# EasyEDA schematic SCH_Pult-v1.1_2025-10-03.json

## Sheets
1 Power Source ＆ Charging Circuit
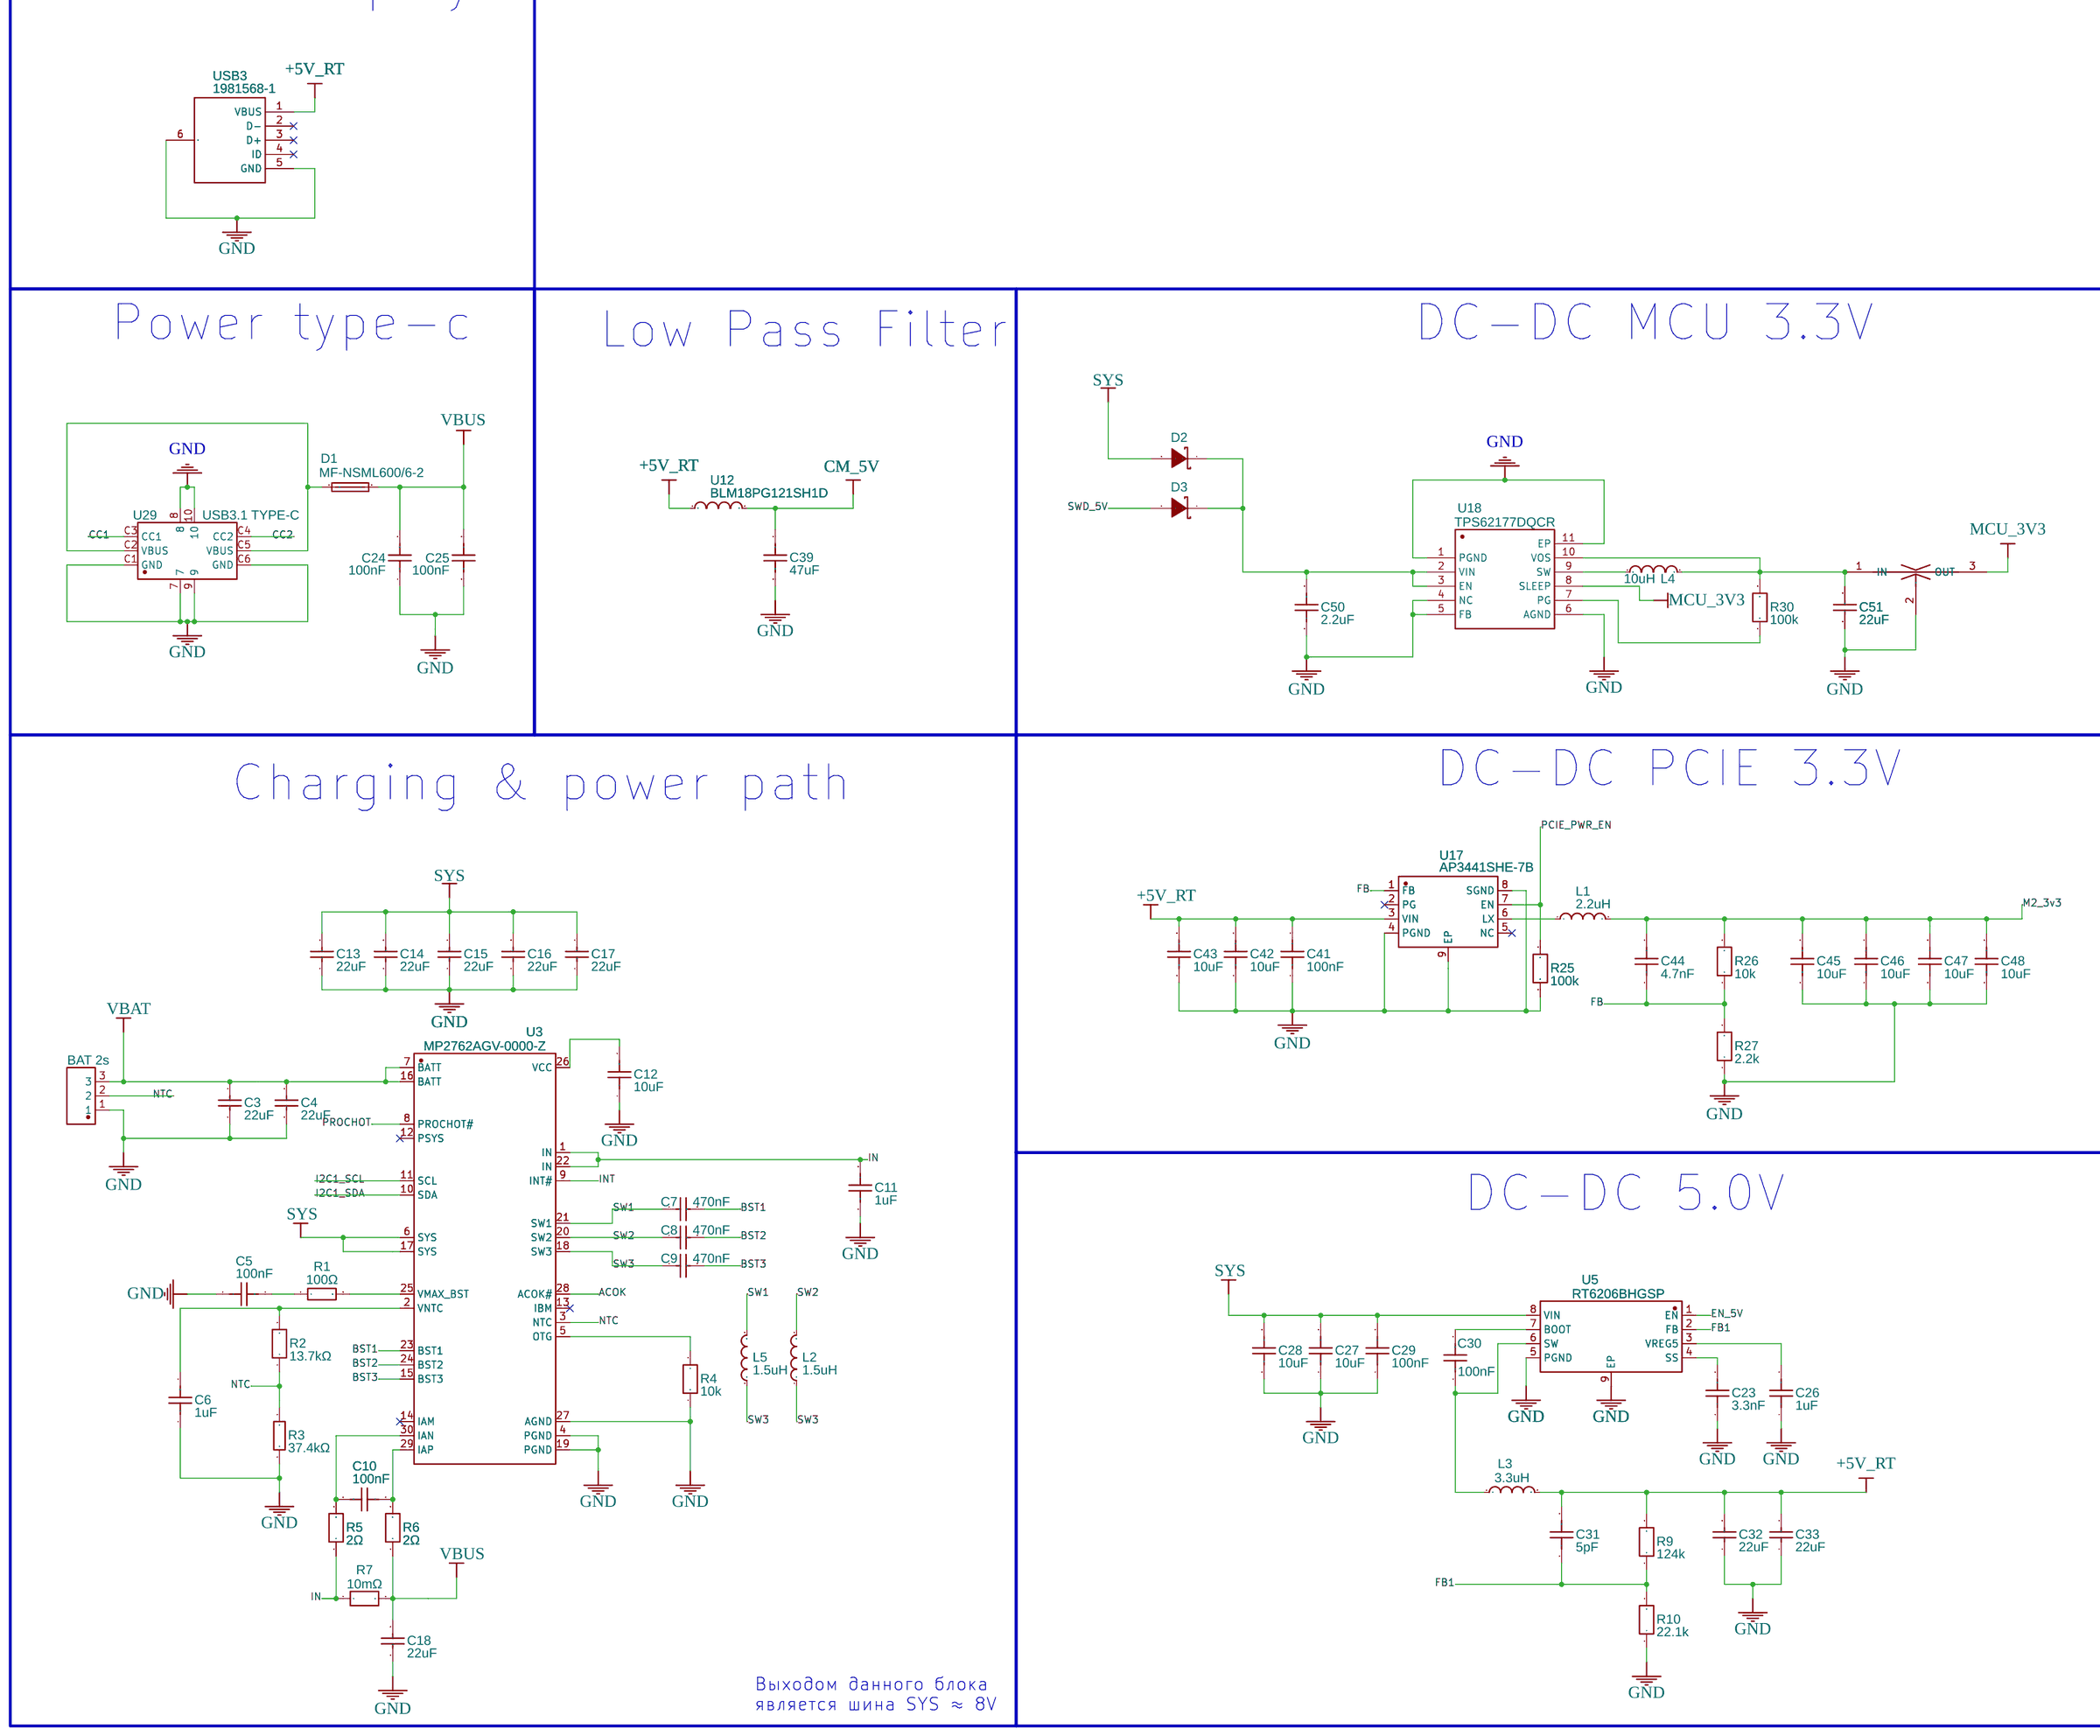
[diagram p0: Power Source ＆ Charging Circuit]
2 MCU and Stick & Button
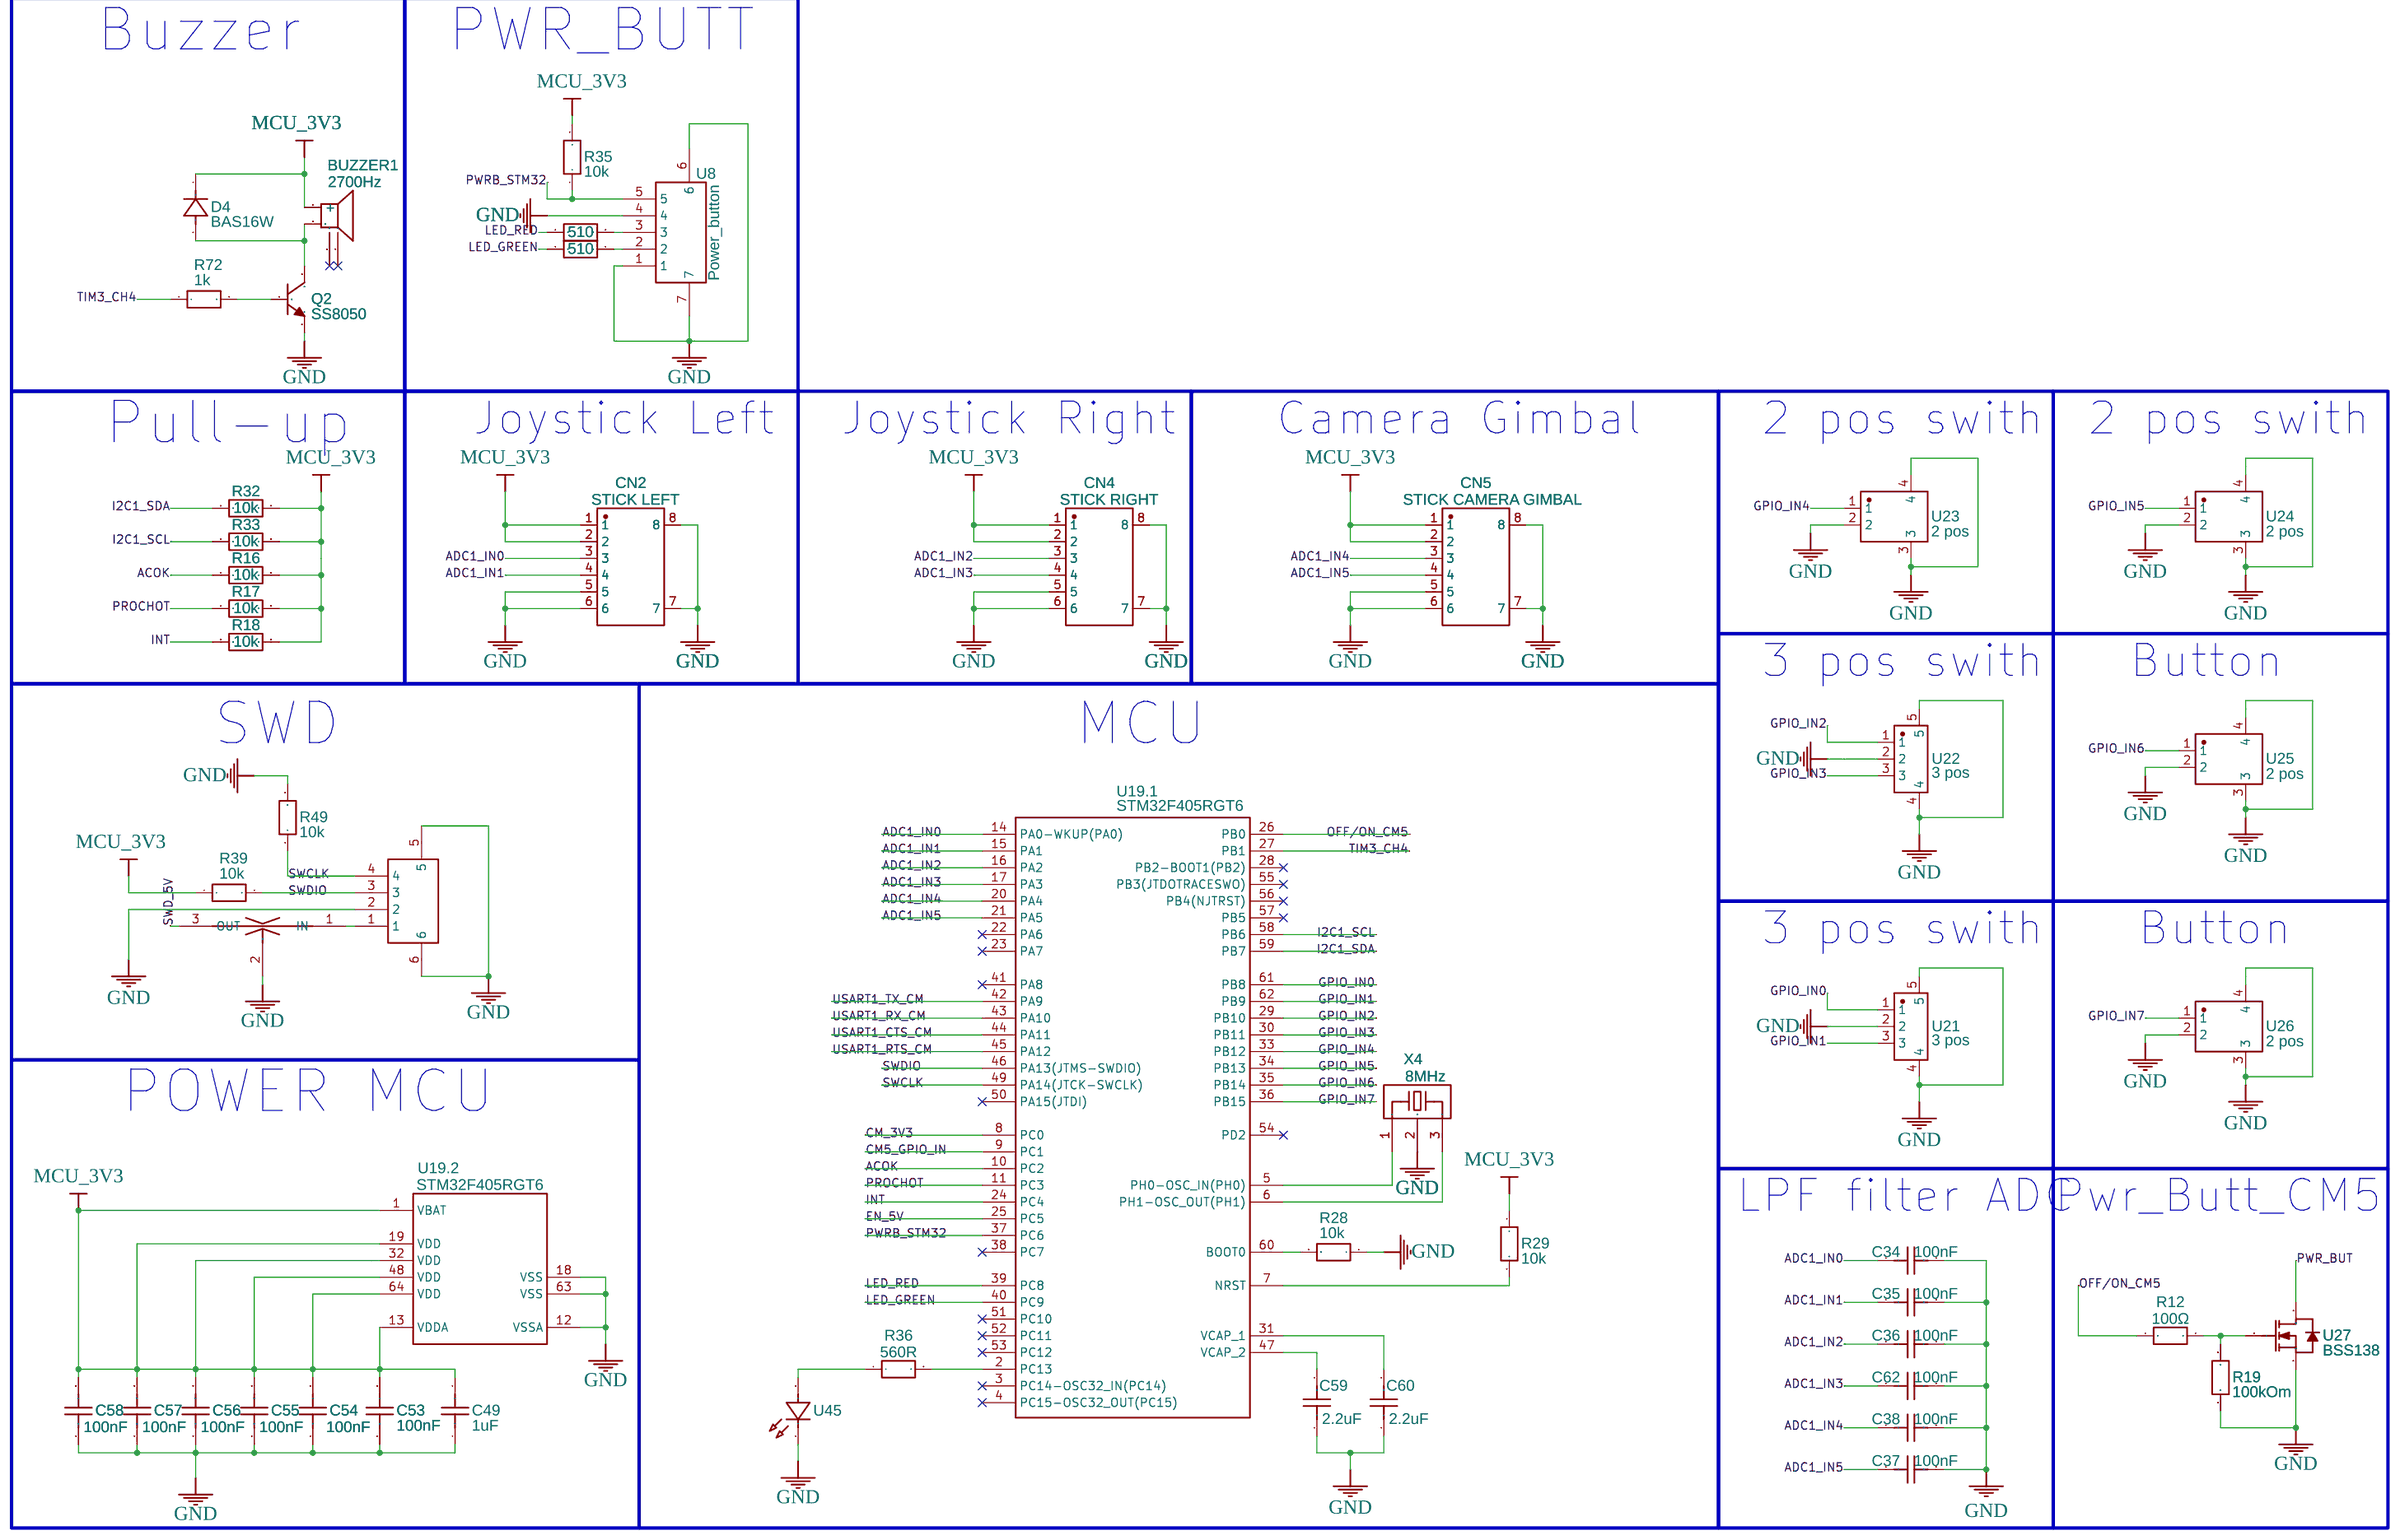
[diagram p1: MCU and Stick & Button]
3 Raspberry CM5
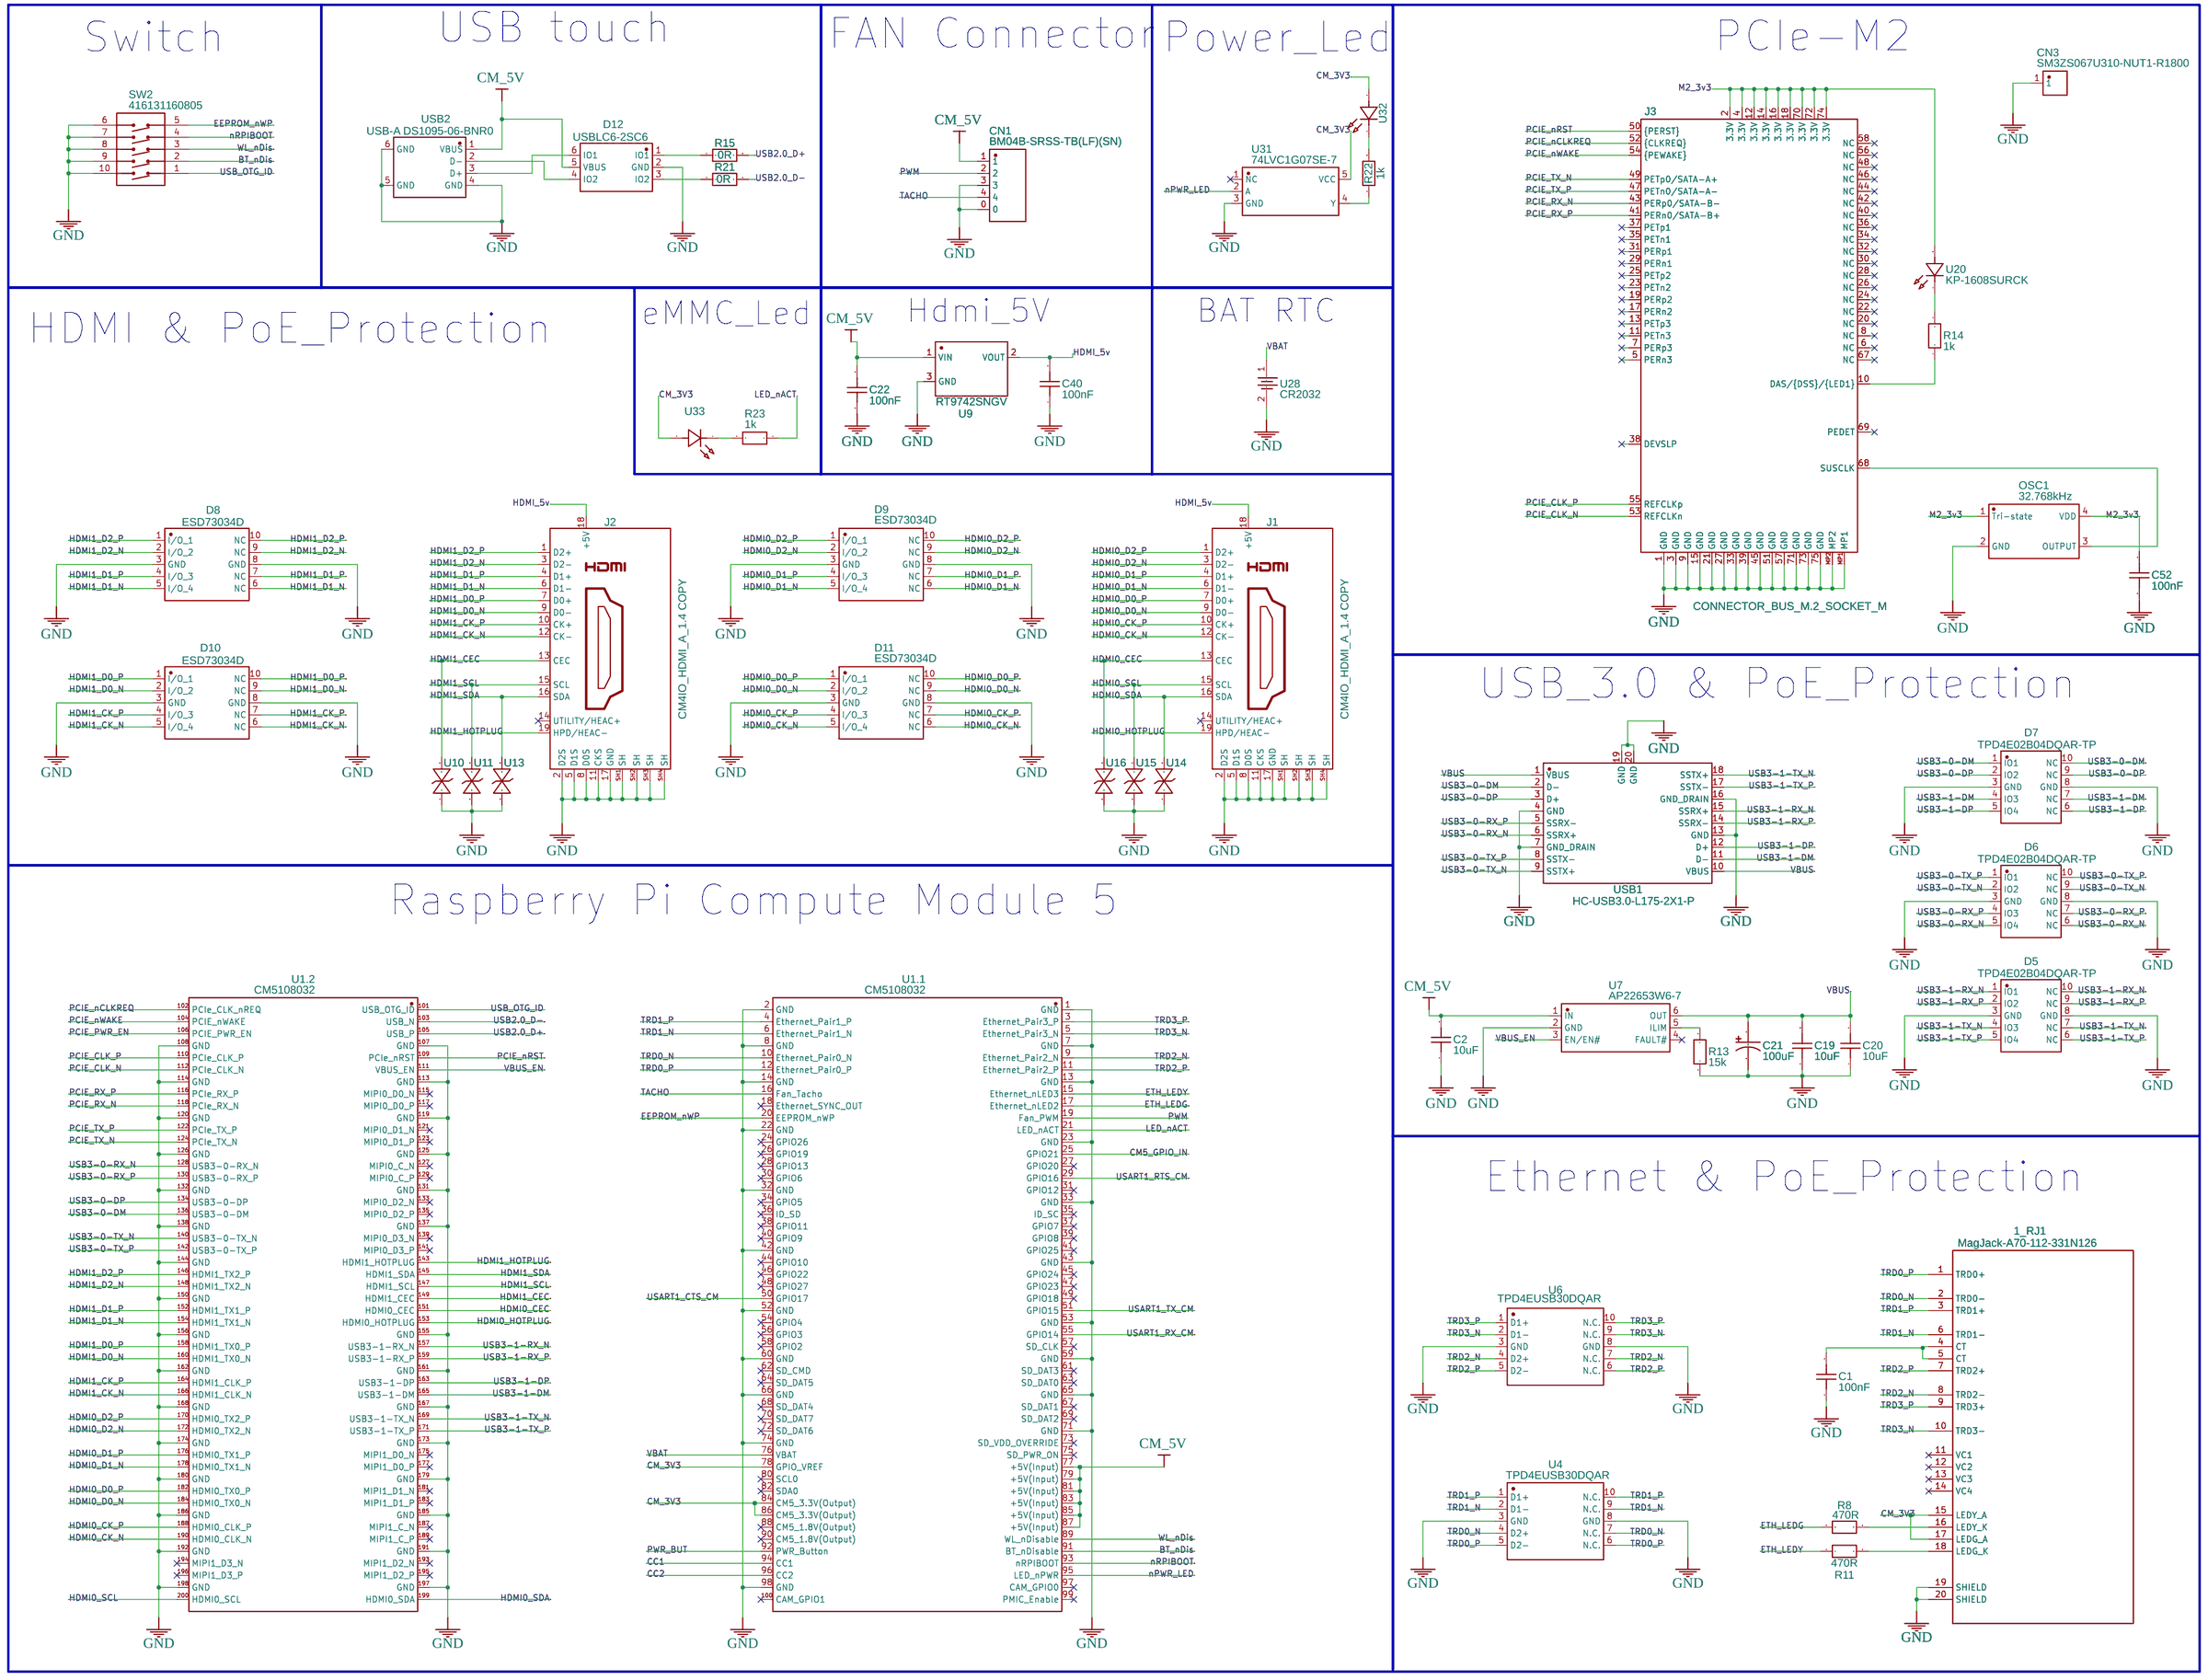
[diagram p2: Raspberry CM5]

## Parts
sheet MCU and Stick & Button
BUZZER1  2700Hz  [BUZ-SMD_4P-L8.5-W8.5-P8.50-BR]
C34  100nF  [C0603]
C35  100nF  [C0603]
C36  100nF  [C0603]
C37  100nF  [C0603]
C38  100nF  [C0603]
C49  1uF  [C0603]
C53  100nF  [C0603]
C54  100nF  [C0603]
C55  100nF  [C0603]
C56  100nF  [C0603]
C57  100nF  [C0603]
C58  100nF  [C0603]
C59  2.2uF  [C0603]
C60  2.2uF  [C0603]
C61  -  [FILTER-SMD_3P-L1.6-W0.8-L_NFM18CC223R1C3D]
C62  100nF  [C0603]
CN2  STICK LEFT  [CONN-TH_SM06B-GHS-TB-LF-SN]
CN4  STICK RIGHT  [CONN-TH_SM06B-GHS-TB-LF-SN]
CN5  STICK CAMERA GIMBAL  [CONN-TH_SM06B-GHS-TB-LF-SN]
D4  BAS16W  [SOD-123_L2.7-W1.6-LS3.7-RD]
Q2  SS8050  [SOT-23-3_L2.9-W1.3-P1.90-LS2.4-BR]
R12  100Ω  [R0402]
R16  10k  [R0603]
R17  10k  [R0603]
R18  10k  [R0603]
R19  100kOm  [R0402]
R20  510  [R0603]
R28  10k  [R0603]
R29  10k  [R0603]
R32  10k  [R0603]
R33  10k  [R0603]
R34  510  [R0603]
R35  10k  [R0603]
R36  560R  [R0603]
R39  10k  [R0603]
R49  10k  [R0603]
R72  1k  [R0603]
U8  Power_button  [CONN-SMD_5P-P1.25_SM05B-GHS-TB-LF-SN]
U19  STM32F405RGT6  [LQFP-64_L10.0-W10.0-P0.50-LS12.0-BL]  (sections 1,2)
U21  3 pos  [CONN-TH_SM03B-GHS-TB-LF-SN]
U22  3 pos  [CONN-TH_SM03B-GHS-TB-LF-SN]
U23  2 pos  [CONN-SMD_SM02B-GHS-TB-LF-SN]
U24  2 pos  [CONN-SMD_SM02B-GHS-TB-LF-SN]
U25  2 pos  [CONN-SMD_SM02B-GHS-TB-LF-SN]
U26  2 pos  [CONN-SMD_SM02B-GHS-TB-LF-SN]
U27  BSS138  [SOT-23-3_L2.9-W1.4-P1.90-LS2.5-BR]
U30  SM04B-GHS-TB(LF)(SN)  [CONN-SMD_4P-P1.25_SM04B-GHS-TB-LF-SN]
U45  KP-1608SURCK  [LED0603-RD_RED]
X4  8MHz  [OSC-SMD_3P-L3.2-W1.3-P1.2-L]
sheet Power Source ＆ Charging Circuit
C3  22uF  [C0805]
C4  22uF  [C0805]
C5  100nF  [C0603]
C6  1uF  [C0603]
C7  470nF  [C0603]
C8  470nF  [C0603]
C9  470nF  [C0603]
C10  100nF  [C0603]
C11  1uF  [C0603]
C12  10uF  [C0603]
C13  22uF  [C0805]
C14  22uF  [C0805]
C15  22uF  [C0805]
C16  22uF  [C0805]
C17  22uF  [C0805]
C18  22uF  [C0805]
C23  3.3nF  [C0603]
C24  100nF  [C0603]
C25  100nF  [C0603]
C26  1uF  [C0603]
C27  10uF  [C0603]
C28  10uF  [C0603]
C29  100nF  [C0603]
C30  100nF  [C0603]
C31  5pF  [C0603]
C32  22uF  [C0805]
C33  22uF  [C0805]
C39  47uF  [C0603]
C41  100nF  [C0603]
C42  10uF  [C0603]
C43  10uF  [C0603]
C44  4.7nF  [C0603]
C45  10uF  [C0603]
C46  10uF  [C0603]
C47  10uF  [C0603]
C48  10uF  [C0603]
C50  2.2uF  [C0603]
C51  22uF  [C0805]
C63  -  [FILTER-SMD_3P-L1.6-W0.8-L_NFM18CC223R1C3D]
D1  MF-NSML600/6-2  [F1206]
D2  BAT60AE6327HTSA1  [SOD-323_L1.8-W1.3-LS2.5-RD]
D3  BAT60AE6327HTSA1  [SOD-323_L1.8-W1.3-LS2.5-RD]
L1  2.2uH  [IND-SMD_L3.0-W3.0_IHLP-1212BZ]
L2  1.5uH  [IND-SMD_L5.5-W5.2]
L3  3.3uH  [IND-SMD_L6.5-W6.5_IHLP-2525]
L4  10uH  [IND-SMD_L4.0-W4.0_VLCF4020]
L5  1.5uH  [IND-SMD_L5.5-W5.2]
R1  100Ω  [R0603]
R2  13.7kΩ  [R0603]
R3  37.4kΩ  [R0603]
R4  10k  [R0603]
R5  2Ω  [R0603]
R6  2Ω  [R0603]
R7  10mΩ  [R1206]
R9  124k  [R0603]
R10  22.1k  [R0603]
R25  100k  [R0603]
R26  10k  [R0603]
R27  2.2k  [R0603]
R30  100k  [R0603]
U2  BAT 2s  [CONN-TH_XH2.54-3P]
U3  MP2762AGV-0000-Z  [QFN-30_L5.0-W4.0-P0.50-TL_MP2762A]
U5  RT6206BHGSP  [SOP-8_L4.9-W3.9-P1.27-LS6.0-BL-EP-2]
U12  BLM18PG121SH1D  [L0603]
U17  AP3441SHE-7B  [DFN2020-8_L2.0-W2.0-P0.50-BL-EP]
U18  TPS62177DQCR  [WSON-10_L3.0-W2.0-P0.50-BL-EP]
U29  USB3.1 TYPE-C  [USB-TYPE-C-SMD_TYPE-C-6P-USB3.1TYPE-C06PF-073]
USB3  1981568-1  [MICRO-USB-SMD_1981568-1]
sheet Raspberry CM5
1_RJ1  MagJack-A70-112-331N126  [TRJG0926HENL_MAGJACK1]
C1  100nF  [C0603]
C2  10uF  [C0603]
C19  10uF  [C0603]
C20  10uF  [C0603]
C21  100uF  [CAP-SMD_BD6.3-L6.6-W6.6-LS7.2-FD]
C22  100nF  [C0603]
C40  100nF  [C0603]
C52  100nF  [C0603]
CN1  BM04B-SRSS-TB(LF)(SN)  [CONN-SMD_BM04B-SRSS-TB]
CN3  SM3ZS067U310-NUT1-R1800  [SMD-1_BD4.5-D2.5]
D5  TPD4E02B04DQAR-TP  [DFN2510-10_L2.5-W1.0-P0.50-BL]
D6  TPD4E02B04DQAR-TP  [DFN2510-10_L2.5-W1.0-P0.50-BL]
D7  TPD4E02B04DQAR-TP  [DFN2510-10_L2.5-W1.0-P0.50-BL]
D8  ESD73034D  [DFN-10_L2.5-W1.0-P0.50-BL-2]
D9  ESD73034D  [DFN-10_L2.5-W1.0-P0.50-BL-2]
D10  ESD73034D  [DFN-10_L2.5-W1.0-P0.50-BL-2]
D11  ESD73034D  [DFN-10_L2.5-W1.0-P0.50-BL-2]
D12  USBLC6-2SC6  [SOT-23-6_L2.9-W1.6-P0.95-LS2.8-BL]
J1  CM4IO_HDMI_A_1.4 COPY  [CM4IO:EDAC 690-019-298-412]
J2  CM4IO_HDMI_A_1.4 COPY  [CM4IO:EDAC 690-019-298-412]
J3  CONNECTOR_BUS_M.2_SOCKET_M  [A_HDJ_LIBRARY:PCIE_M.2_CONNECTORS_P=0.5MM_H=4.2MM_KEYM]
OSC1  32.768kHz  [OSC-SMD_4P-L3.2-W2.5-BL-1]
R8  470R  [R0603]
R11  470R  [R0603]
R13  15k  [R0603]
R14  1k  [R0603]
R15  0R  [R0603]
R21  0R  [R0603]
R22  1k  [R0603]
R23  1k  [R0603]
SW2  416131160805  [SW-SMD_416131160805]
U1  CM5108032  [COMM-SMD_L55.0-W40.0_CM5]  (sections 1,2)
U4  TPD4EUSB30DQAR  [USON-10_L2.5-W1.0-P0.50-BL]
U6  TPD4EUSB30DQAR  [USON-10_L2.5-W1.0-P0.50-BL]
U7  AP22653W6-7  [SOT-23-6_L2.9-W1.6-P0.95-LS2.8-BR]
U9  RT9742SNGV  [SOT-23-3_L2.9-W1.6-P1.90-LS2.8-BR]
U10  ESD5311N  [DFN1006-2L-BI]
U11  ESD5311N  [DFN1006-2L-BI]
U13  ESD5311N  [DFN1006-2L-BI]
U14  ESD5311N  [DFN1006-2L-BI]
U15  ESD5311N  [DFN1006-2L-BI]
U16  ESD5311N  [DFN1006-2L-BI]
U20  KP-1608SURCK  [LED0603-RD_RED]
U28  CR2032  [BAT-TH_CR2032-1]
U31  74LVC1G07SE-7  [SC-88A_L2.0-W1.3-P0.65-LS2.1-BL]
U32  KP-1608SURCK  [LED0603-RD_RED]
U33  KP-1608SURCK  [LED0603-RD_RED]
USB1  HC-USB3.0-L175-2X1-P  [USB-A-TH_H181-AF2R06-12ALCR]
USB2  USB-A DS1095-06-BNR0  [USB-A DS1095-06-BNR)]

## Library data of the parts
BUZZER1 = MLT-8530: Supplier: LCSC; Manufacturer: 华能; Supplier Part: C94599; JLCPCB Part Class: Extended Part
C1 C2 C6 C19 C20 C22 C23 C26-C31 C34-C50 C52-C60 C62 = C_0603_US: Contributor: LCEDA_Lib
C61 C63 = NFM18PC104R1C3D: Supplier: LCSC; Manufacturer: muRata(村田); Supplier Part: C111493; JLCPCB Part Class: Extended Part
CN2 CN4 CN5 = SM06B-GHS-TB(LF)(SN): Contributor: LCSC; Supplier: LCSC; Supplier Part: C133065; Manufacturer: JST; JLCPCB Part Class: Extended Part
D4 = BAS16W_C699061: Contributor: LCSC; Supplier: LCSC; Supplier Part: C699061; Manufacturer: YANGJIE(扬杰); JLCPCB Part Class: Extended Part
Q2 = SS8050: Contributor: LCSC; Supplier: LCSC; Supplier Part: C908250; Manufacturer: FUXINSEMI(富芯森美); JLCPCB Part Class: Extended Part
R12 R19 = R_0402_EU: Contributor: LCEDA_Lib
R2 R4-R6 R8-R11 R13-R18 R20-R23 R25-R30 R32-R36 R39 R49 R72 = R_0603_EU: Contributor: LCEDA_Lib
U8 = SM05B-GHS-TB(LF)(SN): Contributor: LCSC; Supplier: LCSC; Supplier Part: C189896; Manufacturer: JST; JLCPCB Part Class: Extended Part
U19 = STM32F405RGT6: tags: STM32; subpart_no: 1; image: http://image.lceda.cn/szlcsc/C15742.jpg; Supplier Part: C15742; Supplier: LCSC; Manufacturer: ST(意法半导体); JLCPCB Part Class: Extended Part
U21 U22 = SM03B-GHS-TB(LF)(SN): Contributor: LCSC; Supplier: LCSC; Supplier Part: C514175; Manufacturer: JST; JLCPCB Part Class: Extended Part
U23-U26 = SM02B-GHS-TB(LF)(SN): Contributor: LCSC; Supplier: LCSC; Supplier Part: C189893; Manufacturer: JST; JLCPCB Part Class: Extended Part
U27 = BSS138: Supplier: LCSC; Supplier Part: C19272192; Manufacturer: Zhengxin(正芯); Contributor: lcsc
U30 = SM04B-GHS-TB(LF)(SN): Contributor: LCSC; Supplier: LCSC; Supplier Part: C189895; Manufacturer: JST; JLCPCB Part Class: Extended Part
U20 U32 U33 U45 = KP-1608SURCK: Contributor: lcsc; Supplier: LCSC; Supplier Part: C5875718; Manufacturer: Kingbright; JLCPCB Part Class: Extended Part
X4 = CSTCE8M00G52-R0: Supplier: LCSC; Manufacturer: muRata(村田); Supplier Part: C22549; JLCPCB Part Class: Extended Part
C3 C4 C13-C18 C32 C33 C51 = GRM21BR61E226ME44L: Supplier: LCSC; Manufacturer: muRata(村田); Supplier Part: C86816; JLCPCB Part Class: Extended Part
C5 C10 C24 C25 = CC0603KRX7R0BB104: Contributor: LCSC; Supplier: LCSC; Supplier Part: C113803; Manufacturer: YAGEO(国巨); JLCPCB Part Class: Extended Part
C7-C9 = CL10B474KA8NNNC: Supplier: LCSC; Manufacturer: SAMSUNG(三星); Supplier Part: C1623; JLCPCB Part Class: Basic Part
C11 C12 = GRM188R61A105KA61D: Supplier: LCSC; Manufacturer: muRata(村田); Supplier Part: C86012; JLCPCB Part Class: Extended Part
D1 = MF-NSML600/6-2: Contributor: LCSC; Supplier: LCSC; Supplier Part: C1972893; Manufacturer: BOURNS; JLCPCB Part Class: Extended Part
D2 D3 = BAT60AE6327HTSA1: Contributor: LCSC; Supplier: LCSC; Supplier Part: C117485; Manufacturer: Infineon(英飞凌); Manufacturer Part: BAT60AE6327; JLCPCB Part Class: Extended Part
L1 = IHLP1212BZER2R2M11: Contributor: LCSC; Supplier: LCSC; Supplier Part: C553996; Manufacturer: VISHAY(威世); JLCPCB Part Class: Extended Part
L2 L5 = IHLP2020CZER2R2M01: Contributor: lcsc; Supplier: LCSC; Supplier Part: C845003; Manufacturer: VISHAY(威世); JLCPCB Part Class: Extended Part
L3 = IHLP2525CZER3R3M01: Contributor: LCSC; Supplier: LCSC; Supplier Part: C506574; Manufacturer: VISHAY(威世); JLCPCB Part Class: Extended Part
L4 = VLCF4020T-100MR85: Contributor: LCSC; Supplier: LCSC; Manufacturer: TDK; Supplier Part: C136244; JLCPCB Part Class: Extended Part
R1 = AC0603FR-07100RL: Supplier: LCSC; Manufacturer: YAGEO(国巨); Supplier Part: C125923; JLCPCB Part Class: Extended Part
R3 = RC0603FR-0737K4L: Contributor: LCSC; JLCPCB Part Class: Extended Part; Supplier: LCSC; Manufacturer: YAGEO(国巨); Supplier Part: C163425
R7 = WSL1206R0100FEA: Contributor: lcsc; Supplier: LCSC; Supplier Part: C844894; Manufacturer: VISHAY(威世); JLCPCB Part Class: Extended Part
U2 = XH2.54-3P 直插: Contributor: LCSC; Supplier: LCSC; Supplier Part: C9900000727; Manufacturer: null; JLCPCB Part Class: Extended Part
U3 = MP2762AGV-0000-Z: Supplier: LCSC; Supplier Part: C26697965; Manufacturer: MPS(芯源); Contributor: lcsc; JLCPCB Part Class: Extended Part
U5 = RT6206BHGSP: Contributor: LCSC; Supplier: LCSC; Supplier Part: C250401; Manufacturer: RICHTEK(立锜); JLCPCB Part Class: Extended Part
U12 = BLM18PG121SH1D: Contributor: LCSC; Supplier: LCSC; Supplier Part: C354394; Manufacturer: muRata(村田); JLCPCB Part Class: Extended Part
U17 = AP3441SHE-7B: Contributor: LCSC; Supplier: LCSC; Supplier Part: C2070918; Manufacturer: DIODES(美台); JLCPCB Part Class: Extended Part
U18 = TPS62177DQCR: Supplier: LCSC; Manufacturer: TI(德州仪器); Supplier Part: C91241; JLCPCB Part Class: Extended Part
U29 = USB3.1 TYPE-C 06PF-073: Supplier: LCSC; Supplier Part: C9900187208; Manufacturer: null; Contributor: lcsc
USB3 = 1981568-1: Contributor: LCSC; Supplier: LCSC; Supplier Part: C428487; Manufacturer: TE Connectivity(泰科电子); JLCPCB Part Class: Extended Part
1_RJ1 = MagJack-A70-112-331N126: Manufacturer: LINK-PP; link: http://www.link-pp.com/?product/201804116137.html; Contributor: spkt-thi
C21 = 100UF/16V-6.3X5.4: Contributor: LCSC; Supplier: LCSC; Supplier Part: C9900004520; Manufacturer Part: 100uF/16V-6.3x5.4; Manufacturer: null; JLCPCB Part Class: Extended Part
CN1 = BM04B-SRSS-TB(LF)(SN): Contributor: LCSC; Supplier: LCSC; Supplier Part: C160390; Manufacturer: JST; JLCPCB Part Class: Extended Part
CN3 = SM3ZS067U310-NUT1-R1800: Supplier: LCSC; Supplier Part: C5221772; Manufacturer: JAE(日本航空电子); JLCPCB Part Class: Extended Part; Contributor: lcsc
D5-D7 = TPD4E02B04DQAR-TP: Contributor: LCSC; Supplier: LCSC; Supplier Part: C2841426; Manufacturer: TECH PUBLIC(台舟); JLCPCB Part Class: Extended Part
D8-D11 = ESD73034D: Supplier: LCSC; Supplier Part: C7202962; Manufacturer: TECH PUBLIC(台舟); JLCPCB Part Class: Extended Part; Contributor: lcsc
D12 = USBLC6-2SC6_C2827654: Contributor: LCSC; Supplier: LCSC; Supplier Part: C2827654; Manufacturer: TECH PUBLIC(台舟); JLCPCB Part Class: Extended Part
J1 J2 = CM4IO_HDMI_A_1.4 COPY: Symbol: CM4IO_HDMI_A_1.4; Device: CM4IO_HDMI_A_1.4; field4: Farnell; field5: 2614936; field6: 690-019-298-412; field7: EDAC; field8: UCON00802; part description: HDMI Connector, Right Angle, 19 Contacts, Receptacle, Surface Mount, Surface Mount Right Angle; User doc link: https://www.tme.eu/Document/f15dffbcfad8545e17826f72d36911c8/206A-SEAN-R03.pdf; Add into BOM: yes; Convert to PCB: yes; Origin Footprint: CM4IO:EDAC 690-019-298-412; Field4: Farnell; Field5: 2614936; Field6: 690-019-298-412; Field7: EDAC; Part Description: HDMI Connector, Right Angle, 19 Contacts, Receptacle, Surface Mount, Surface Mount Right Angle; Field8: UCON00802; Contributor: Steve Forest
J3 = CONNECTOR_BUS_M.2_SOCKET_M: Symbol: Connector_Bus_M.2_Socket_M; Device: Connector_Bus_M.2_Socket_M; User doc link: http://read.pudn.com/downloads794/doc/project/3133918/PCIe_M.2_Electromechanical_Spec_Rev1.0_Final_11012013_RS_Clean.pdf#page=155; Add into BOM: yes; Convert to PCB: yes; Origin Footprint: PCIe_M.2_Connectors_P=0.5mm_H=4.2mm_KeyM; Comment: Connector_Bus_M.2_Socket_M; Contributor: najsar
OSC1 = ASEK-32.768KHZ-LRT: Contributor: lcsc; Supplier: LCSC; Supplier Part: C2650753; Manufacturer: ABRACON; JLCPCB Part Class: Extended Part
SW2 = 416131160805: Supplier: LCSC; Supplier Part: C6812612; Manufacturer: Wurth(伍尔特); Contributor: lcsc; JLCPCB Part Class: Extended Part
U1 = CM5108032: Supplier: LCSC; Supplier Part: C42394223; Manufacturer: Raspberry Pi(树莓派); subpart_no: 1
U4 U6 = TPD4EUSB30DQAR: Contributor: LCSC; Supplier: LCSC; Manufacturer: TI(德州仪器); Supplier Part: C90627; JLCPCB Part Class: Extended Part
U7 = AP22653W6-7: Contributor: LCSC; Supplier: LCSC; Supplier Part: C2158037; Manufacturer: DIODES(美台); JLCPCB Part Class: Extended Part
U9 = RT9742SNGV COPY: Contributor: LCSC; Supplier: LCSC; Supplier Part: C2892807; Manufacturer: null; JLCPCB Part Class: Extended Part
U10 U11 U13-U16 = ESD5311N: Supplier: LCSC; Supplier Part: C2936982; Manufacturer: TECH PUBLIC(台舟); JLCPCB Part Class: Extended Part; Contributor: lcsc
U28 = CR2032_C9900007674: Contributor: lcsc; Supplier: LCSC; Supplier Part: C9900007674; Manufacturer: null; JLCPCB Part Class: Extended Part
U31 = 74LVC1G07SE-7: Contributor: LCSC; Supplier: LCSC; Supplier Part: C67531; Manufacturer: DIODES(美台); JLCPCB Part Class: Extended Part
USB1 = HC-USB3.0-L175-2X1-P: Supplier: LCSC; Supplier Part: C7501881; Manufacturer: HC(虹成电子); Contributor: lcsc; JLCPCB Part Class: Extended Part
USB2 = USB-A DS1095-06-BNR0: Supplier: LCSC; Supplier Part: C720525; Manufacturer: Zhendin; Manufacturer Part: DS1095-06BNR0; Contributor: Рустем Равилов; JLCPCB Part Class: Extended Part; link: https://www.chipdip.ru/product/ds1095-06-bnr0

## Nets
+5V_RT: C31.2 C32.2 C33.2 C41.2 C42.2 C43.2 L3.2 R9.2 U12.1 U17.3(VIN) USB3.1(VBUS)
GND: 1_RJ1.19(SHIELD) 1_RJ1.20(SHIELD) C1.1 C2.1 C3.1 C4.1 C5.1 C6.1 C11.1 C12.1 C13.1 C14.1 C15.1 C16.1 C17.1 C18.1 C19.1 C20.1 C21.2 C22.1 C23.1 C24.1 C25.1 C26.1 C27.1 C28.1 C29.1 C32.1 C33.1 C34.2 C35.2 C36.2 C37.2 C38.2 C39.1 C40.1 C41.1 C42.1 C43.1 C45.1 C46.1 C47.1 C48.1 C49.1 C50.1 C51.1 C52.2 C53.1 C54.1 C55.1 C56.1 C57.1 C58.1 C59.1 C60.1 C61.2(GND) C62.2 C63.2(GND) CN1.0 CN1.3 CN2.5 CN2.6 CN2.7 CN2.8 CN3.1 CN4.5 CN4.6 CN4.7 CN4.8 CN5.5 CN5.6 CN5.7 CN5.8 D5.3(GND) D5.8(GND) D6.3(GND) D6.8(GND) D7.3(GND) D7.8(GND) D8.3(GND) D8.8(GND) D9.3(GND) D9.8(GND) D10.3(GND) D10.8(GND) D11.3(GND) D11.8(GND) D12.2(GND) J1.2(D2S) J1.5(D1S) J1.8(D0S) J1.11(CKS) J1.17(GND) J1.SH1(SH) J1.SH2(SH) J1.SH3(SH) J1.SH4(SH) J2.2(D2S) J2.5(D1S) J2.8(D0S) J2.11(CKS) J2.17(GND) J2.SH1(SH) J2.SH2(SH) J2.SH3(SH) J2.SH4(SH) J3.1(GND) J3.3(GND) J3.9(GND) J3.15(GND) J3.21(GND) J3.27(GND) J3.33(GND) J3.39(GND) J3.45(GND) J3.51(GND) J3.57(GND) J3.71(GND) J3.73(GND) J3.75(GND) J3.MP1 J3.MP2 OSC1.2(GND) Q2.2(E) R3.2 R4.1 R10.1 R13.1 R19.1 R25.1 R27.1 R28.1 R49.2 SW2.6 SW2.7 SW2.8 SW2.9 SW2.10 U1.1(GND) U1.2(GND) U1.7(GND) U1.8(GND) U1.13(GND) U1.14(GND) U1.22(GND) U1.23(GND) U1.32(GND) U1.33(GND) U1.42(GND) U1.43(GND) U1.52(GND) U1.53(GND) U1.59(GND) U1.60(GND) U1.65(GND) U1.66(GND) U1.71(GND) U1.74(GND) U1.98(GND) U1.107(GND) U1.108(GND) U1.113(GND) U1.114(GND) U1.119(GND) U1.120(GND) U1.125(GND) U1.126(GND) U1.131(GND) U1.132(GND) U1.137(GND) U1.138(GND) U1.144(GND) U1.150(GND) U1.155(GND) U1.156(GND) U1.161(GND) U1.162(GND) U1.167(GND) U1.168(GND) U1.173(GND) U1.174(GND) U1.179(GND) U1.180(GND) U1.185(GND) U1.186(GND) U1.191(GND) U1.192(GND) U1.197(GND) U1.198(GND) U2.1 U3.4(PGND) U3.19(PGND) U3.27(AGND) U4.3(GND) U4.8(GND) U5.5(PGND) U5.9(EP) U6.3(GND) U6.8(GND) U7.2(GND) U8.1 U8.4 U8.6 U8.7 U9.3(GND) U10.1 U11.1 U13.1 U14.1 U15.1 U16.1 U17.4(PGND) U17.8(SGND) U17.9(EP) U18.1(PGND) U18.4(NC) U18.5(FB) U18.6(AGND) U18.11(EP) U19.12(VSSA) U19.18(VSS) U19.63(VSS) U21.2 U21.4 U21.5 U22.2 U22.4 U22.5 U23.2 U23.3 U23.4 U24.2 U24.3 U24.4 U25.2 U25.3 U25.4 U26.2 U26.3 U26.4 U27.2(S) U28.2 U29.7 U29.8 U29.9 U29.10 U29.C1(GND) U29.C6(GND) U30.2 U30.5 U30.6 U31.3(GND) U45.1(K) USB1.4(GND) USB1.7(GND_DRAIN) USB1.13(GND) USB1.16(GND_DRAIN) USB1.19(GND) USB1.20(GND) USB2.4(GND) USB2.5(GND) USB2.6(GND) USB3.5(GND) USB3.6(EH) X4.2
VBAT: C3.2 C4.2 U1.76(VBAT) U2.3 U3.7(BATT) U3.16(BATT) U28.1
VBUS: C18.2 C19.2 C20.2 C21.1 C24.2 C25.2 D1.2 R6.1 R7.2 U7.6(OUT) USB1.1(VBUS) USB1.10(VBUS)
VBUS_EN: U1.111(VBUS_EN) U7.3(EN/EN#)
ACOK: R16.1 U3.28(ACOK#) U19.10(PC2)
ADC1_IN0: C34.1 CN2.3 U19.14(PA0-WKUP(PA0))
ADC1_IN1: C35.1 CN2.4 U19.15(PA1)
ADC1_IN2: C36.1 CN4.3 U19.16(PA2)
ADC1_IN3: C62.1 CN4.4 U19.17(PA3)
ADC1_IN4: C38.1 CN5.3 U19.20(PA4)
ADC1_IN5: C37.1 CN5.4 U19.21(PA5)
BST1: C7.2 U3.23(BST1)
BST2: C8.2 U3.24(BST2)
BST3: C9.2 U3.15(BST3)
BT_nDis: SW2.2 U1.91(BT_nDisable)
CC1: U1.94(CC1) U29.C3(CC1)
CC2: U1.96(CC2) U29.C4(CC2)
CM5_GPIO_IN: U1.25(GPIO21) U19.9(PC1)
CM_3V3: 1_RJ1.15(LEDY_A) 1_RJ1.17(LEDG_A) U1.78(GPIO_VREF) U1.84(CM5_3.3V(Output)) U1.86(CM5_3.3V(Output)) U19.8(PC0) U31.5(VCC) U32.2(A) U33.2(A)
CM_5V: C2.2 C22.2 C39.2 CN1.1 D12.5(VBUS) U1.77(+5V(Input)) U1.79(+5V(Input)) U1.81(+5V(Input)) U1.83(+5V(Input)) U1.85(+5V(Input)) U1.87(+5V(Input)) U7.1(IN) U9.1(VIN) U12.2 USB2.1(VBUS)
EEPROM_nWP: SW2.5 U1.20(EEPROM_nWP)
EN_5V: U5.1(EN) U19.25(PC5)
ETH_LEDG: R8.1 U1.17(Ethernet_nLED2)
ETH_LEDY: R11.1 U1.15(Ethernet_nLED3)
FB: C44.1 R26.1 R27.2 U17.1(FB)
FB1: C31.1 R9.1 R10.2 U5.2(FB)
GPIO_IN0: U19.61(PB8) U21.1
GPIO_IN1: U19.62(PB9) U21.3
GPIO_IN2: U19.29(PB10) U22.1
GPIO_IN3: U19.30(PB11) U22.3
GPIO_IN4: U19.33(PB12) U23.1
GPIO_IN5: U19.34(PB13) U24.1
GPIO_IN6: U19.35(PB14) U25.1
GPIO_IN7: U19.36(PB15) U26.1
HDMI0_CEC: J1.13(CEC) U1.151(HDMI0_CEC) U16.2
HDMI0_CK_N: D11.5(I/O_4) D11.6(NC) J1.12(CK-) U1.190(HDMI0_CLK_N)
HDMI0_CK_P: D11.4(I/O_3) D11.7(NC) J1.10(CK+) U1.188(HDMI0_CLK_P)
HDMI0_D0_N: D11.2(I/O) D11.9(NC) J1.9(D0-) U1.184(HDMI0_TX0_N)
HDMI0_D0_P: D11.1(I/O) D11.10(NC) J1.7(D0+) U1.182(HDMI0_TX0_P)
HDMI0_D1_N: D9.5(I/O_4) D9.6(NC) J1.6(D1-) U1.178(HDMI0_TX1_N)
HDMI0_D1_P: D9.4(I/O_3) D9.7(NC) J1.4(D1+) U1.176(HDMI0_TX1_P)
HDMI0_D2_N: D9.2(I/O) D9.9(NC) J1.3(D2-) U1.172(HDMI0_TX2_N)
HDMI0_D2_P: D9.1(I/O) D9.10(NC) J1.1(D2+) U1.170(HDMI0_TX2_P)
HDMI0_HOTPLUG: J1.19(HPD/HEAC-) U1.153(HDMI0_HOTPLUG)
HDMI0_SCL: J1.15(SCL) U1.200(HDMI0_SCL) U15.2
HDMI0_SDA: J1.16(SDA) U1.199(HDMI0_SDA) U14.2
HDMI1_CEC: J2.13(CEC) U1.149(HDMI1_CEC) U10.2
HDMI1_CK_N: D10.5(I/O_4) D10.6(NC) J2.12(CK-) U1.166(HDMI1_CLK_N)
HDMI1_CK_P: D10.4(I/O_3) D10.7(NC) J2.10(CK+) U1.164(HDMI1_CLK_P)
HDMI1_D0_N: D10.2(I/O) D10.9(NC) J2.9(D0-) U1.160(HDMI1_TX0_N)
HDMI1_D0_P: D10.1(I/O) D10.10(NC) J2.7(D0+) U1.158(HDMI1_TX0_P)
HDMI1_D1_N: D8.5(I/O_4) D8.6(NC) J2.6(D1-) U1.154(HDMI1_TX1_N)
HDMI1_D1_P: D8.4(I/O_3) D8.7(NC) J2.4(D1+) U1.152(HDMI1_TX1_P)
HDMI1_D2_N: D8.2(I/O) D8.9(NC) J2.3(D2-) U1.148(HDMI1_TX2_N)
HDMI1_D2_P: D8.1(I/O) D8.10(NC) J2.1(D2+) U1.146(HDMI1_TX2_P)
HDMI1_HOTPLUG: J2.19(HPD/HEAC-) U1.143(HDMI1_HOTPLUG)
HDMI1_SCL: J2.15(SCL) U1.147(HDMI1_SCL) U11.2
HDMI1_SDA: J2.16(SDA) U1.145(HDMI1_SDA) U13.2
HDMI_5v: C40.2 J1.18(+5V) J2.18(+5V) U9.2(VOUT)
I2C1_SCL: R33.1 U3.11(SCL) U19.58(PB6)
I2C1_SDA: R32.1 U3.10(SDA) U19.59(PB7)
IN: C11.2 R5.1 R7.1 U3.1(IN) U3.22(IN)
INT: R18.1 U3.9(INT#) U19.24(PC4)
LED_GREEN: R34.1 U19.40(PC9)
LED_nACT: R23.1 U1.21(LED_nACT)
LED_RED: R20.1 U19.39(PC8)
M2_3v3: C44.2 C45.2 C46.2 C47.2 C48.2 C52.1 J3.2(3.3V) J3.4(3.3V) J3.12(3.3V) J3.14(3.3V) J3.16(3.3V) J3.18(3.3V) J3.70(3.3V) J3.72(3.3V) J3.74(3.3V) L1.2 OSC1.1(Tri-state) OSC1.4(VDD) R26.2 U20.2(A)
MCU_3V3: BUZZER1.1(+) C49.2 C53.2 C54.2 C55.2 C56.2 C57.2 C58.2 C63.3(OUT) CN2.1 CN2.2 CN4.1 CN4.2 CN5.1 CN5.2 D4.1(K) R16.2 R17.2 R18.2 R29.1 R32.2 R33.2 R35.2 R39.1 U18.8(SLEEP) U19.1(VBAT) U19.13(VDDA) U19.19(VDD) U19.32(VDD) U19.48(VDD) U19.64(VDD)
nPWR_LED: U1.95(LED_nPWR) U31.2(A)
nRPIBOOT: SW2.4 U1.93(nRPIBOOT)
NTC: R2.1 R3.1 U2.2 U3.3(NTC)
OFF/ON_CM5: R12.1 U19.26(PB0)
PCIE_CLK_N: J3.53(REFCLKn) U1.112(PCIe_CLK_N)
PCIE_CLK_P: J3.55(REFCLKp) U1.110(PCIe_CLK_P)
PCIE_nCLKREQ: J3.52({CLKREQ}) U1.102(PCIe_CLK_nREQ)
PCIE_nRST: J3.50({PERST}) U1.109(PCIe_nRST)
PCIE_nWAKE: J3.54({PEWAKE}) U1.104(PCIE_nWAKE)
PCIE_PWR_EN: R25.2 U1.106(PCIE_PWR_EN) U17.7(EN)
PCIE_RX_N: J3.43(PERp0/SATA-B-) U1.118(PCIe_RX_N)
PCIE_RX_P: J3.41(PERn0/SATA-B+) U1.116(PCIe_RX_P)
PCIE_TX_N: J3.49(PETp0/SATA-A+) U1.124(PCIe_TX_N)
PCIE_TX_P: J3.47(PETn0/SATA-A-) U1.122(PCIe_TX_P)
PROCHOT: R17.1 U3.8(PROCHOT#) U19.11(PC3)
PWM: CN1.2 U1.19(Fan_PWM)
PWR_BUT: U1.92(PWR_Button) U27.3(D)
PWRB_STM32: R35.1 U8.5 U19.37(PC6)
SW1: C7.1 L5.2 U3.21(SW1)
SW2: C8.1 L2.2 U3.20(SW2)
SW3: C9.1 L2.1 L5.1 U3.18(SW3)
SWCLK: R49.1 U19.49(PA14(JTCK-SWCLK)) U30.4
SWD_5V: C61.3(OUT) D3.2(A)
SWDIO: R39.2 U19.46(PA13(JTMS-SWDIO)) U30.3
SYS: C13.2 C14.2 C15.2 C16.2 C17.2 C27.2 C28.2 C29.2 D2.2(A) U3.6(SYS) U3.17(SYS) U5.8(VIN)
TACHO: CN1.4 U1.16(Fan_Tacho)
TIM3_CH4: R72.1 U19.27(PB1)
TRD0_N: 1_RJ1.2(TRD0-) U1.10(Ethernet_Pair0_N) U4.4(D2+) U4.7(N.C.)
TRD0_P: 1_RJ1.1(TRD0+) U1.12(Ethernet_Pair0_P) U4.5(D2-) U4.6(N.C.)
TRD1_N: 1_RJ1.6(TRD1-) U1.6(Ethernet_Pair1_N) U4.2(D1-) U4.9(N.C.)
TRD1_P: 1_RJ1.3(TRD1+) U1.4(Ethernet_Pair1_P) U4.1(D1+) U4.10(N.C.)
TRD2_N: 1_RJ1.8(TRD2-) U1.9(Ethernet_Pair2_N) U6.4(D2+) U6.7(N.C.)
TRD2_P: 1_RJ1.7(TRD2+) U1.11(Ethernet_Pair2_P) U6.5(D2-) U6.6(N.C.)
TRD3_N: 1_RJ1.10(TRD3-) U1.5(Ethernet_Pair3_N) U6.2(D1-) U6.9(N.C.)
TRD3_P: 1_RJ1.9(TRD3+) U1.3(Ethernet_Pair3_P) U6.1(D1+) U6.10(N.C.)
USART1_CTS_CM: U1.50(GPIO17) U19.44(PA11)
USART1_RTS_CM: U1.29(GPIO16) U19.45(PA12)
USART1_RX_CM: U1.55(GPIO14) U19.43(PA10)
USART1_TX_CM: U1.51(GPIO15) U19.42(PA9)
USB2.0_D+: R15.2 U1.105(USB_P)
USB2.0_D-: R21.2 U1.103(USB_N)
USB3-0-DM: D7.1(IO1) D7.10(NC) U1.136(USB3-0-DM) USB1.2(D-)
USB3-0-DP: D7.2(IO2) D7.9(NC) U1.134(USB3-0-DP) USB1.3(D+)
USB3-0-RX_N: D6.5(IO4) D6.6(NC) U1.128(USB3-0-RX_N) USB1.6(SSRX+)
USB3-0-RX_P: D6.4(IO3) D6.7(NC) U1.130(USB3-0-RX_P) USB1.5(SSRX-)
USB3-0-TX_N: D6.2(IO2) D6.9(NC) U1.140(USB3-0-TX_N) USB1.9(SSTX+)
USB3-0-TX_P: D6.1(IO1) D6.10(NC) U1.142(USB3-0-TX_P) USB1.8(SSTX-)
USB3-1-DM: D7.4(IO3) D7.7(NC) U1.165(USB3-1-DM) USB1.11(D-)
USB3-1-DP: D7.5(IO4) D7.6(NC) U1.163(USB3-1-DP) USB1.12(D+)
USB3-1-RX_N: D5.1(IO1) D5.10(NC) U1.157(USB3-1-RX_N) USB1.15(SSRX+)
USB3-1-RX_P: D5.2(IO2) D5.9(NC) U1.159(USB3-1-RX_P) USB1.14(SSRX-)
USB3-1-TX_N: D5.4(IO3) D5.7(NC) U1.169(USB3-1-TX_N) USB1.18(SSTX+)
USB3-1-TX_P: D5.5(IO4) D5.6(NC) U1.171(USB3-1-TX_P) USB1.17(SSTX-)
USB_OTG_ID: SW2.1 U1.101(USB_OTG_ID)
WL_nDis: SW2.3 U1.89(WL_nDisable)
Net-(1_RJ1-4): 1_RJ1.4(CT) 1_RJ1.5(CT) C1.2
Net-(1_RJ1-16): 1_RJ1.16(LEDY_K) R8.2
Net-(1_RJ1-18): 1_RJ1.18(LEDG_K) R11.2
Net-(BUZZER1-2): BUZZER1.2 D4.2(A) Q2.3(C)
Net-(C5-2): C5.2 R1.1
Net-(C6-2): C6.2 R2.2 U3.2(VNTC)
Net-(C10-1): C10.1 R5.2 U3.30(IAN)
Net-(C10-2): C10.2 R6.2 U3.29(IAP)
Net-(C12-2): C12.2 U3.26(VCC)
Net-(C23-2): C23.2 U5.4(SS)
Net-(C26-2): C26.2 U5.3(VREG5)
Net-(C30-1): C30.1 L3.1 U5.6(SW)
Net-(C30-2): C30.2 U5.7(BOOT)
Net-(C50-2): C50.2 D2.1(K) D3.1(K) U18.2(VIN) U18.3(EN)
Net-(C51-2): C51.2 C63.1(IN) L4.2 R30.2 U18.10(VOS)
Net-(C59-2): C59.2 U19.47(VCAP_2)
Net-(C60-2): C60.2 U19.31(VCAP_1)
Net-(C61-1): C61.1(IN) U30.1
Net-(D1-1): D1.1 U29.C2(VBUS) U29.C5(VBUS)
Net-(D12-1): D12.1(IO1) R15.1
Net-(D12-3): D12.3(IO2) R21.1
Net-(D12-4): D12.4(IO2) USB2.2(D-)
Net-(D12-6): D12.6(IO1) USB2.3(D+)
Net-(J3-10): J3.10(DAS/{DSS}/{LED1}) R14.1
Net-(J3-68): J3.68(SUSCLK) OSC1.3(OUTPUT)
Net-(L1-1): L1.1 U17.6(LX)
Net-(L4-1): L4.1 U18.9(SW)
Net-(Q2-1): Q2.1(B) R72.2
Net-(R1-2): R1.2 U3.25(VMAX_BST)
Net-(R4-2): R4.2 U3.5(OTG)
Net-(R12-2): R12.2 R19.2 U27.1(G)
Net-(R13-2): R13.2 U7.5(ILIM)
Net-(R14-2): R14.2 U20.1(K)
Net-(R20-2): R20.2 U8.3
Net-(R22-1): R22.1 U31.4(Y)
Net-(R22-2): R22.2 U32.1(K)
Net-(R23-2): R23.2 U33.1(K)
Net-(R28-2): R28.2 U19.60(BOOT0)
Net-(R29-2): R29.2 U19.7(NRST)
Net-(R30-1): R30.1 U18.7(PG)
Net-(R34-2): R34.2 U8.2
Net-(R36-1): R36.1 U45.2(A)
Net-(R36-2): R36.2 U19.2(PC13)
Net-(U19.1-5): U19.5(PH0-OSC_IN(PH0)) X4.1
Net-(U19.1-6): U19.6(PH1-OSC_OUT(PH1)) X4.3

Not connected (* = marked no-connect by the designer): 1_RJ1 11(VC1)* 12(VC2)* 13(VC3)* 14(VC4)*; BUZZER1 3* 4*; J1 14(UTILITY/HEAC+)*; J2 14(UTILITY/HEAC+)*; J3 5(PERn3) 6(NC) 7(PERp3) 8(NC) 11(PETn3) 13(PETp3) 17(PERn2) 19(PERp2) 20(NC) 22(NC) 23(PETn2) 24(NC) 25(PETp2) 26(NC) 28(NC) 29(PERn1) 30(NC) 31(PERp1) 32(NC) 34(NC) 35(PETn1) 36(NC) 37(PETp1) 38(DEVSLP) 40(NC) 42(NC) 44(NC) 46(NC) 48(NC) 56(NC) 58(NC) 67(NC) 69(PEDET); U1 18(Ethernet_SYNC_OUT)* 24(GPIO26)* 26(GPIO19)* 27(GPIO20)* 28(GPIO13)* 30(GPIO6)* 31(GPIO12)* 34(GPIO5)* 35(ID_SC)* 36(ID_SD)* 37(GPIO7)* 38(GPIO11)* 39(GPIO8)* 40(GPIO9)* 41(GPIO25)* 44(GPIO10)* 45(GPIO24)* 46(GPIO22)* 47(GPIO23)* 48(GPIO27)* 49(GPIO18)* 54(GPIO4)* 56(GPIO3)* 57(SD_CLK)* 58(GPIO2)* 61(SD_DAT3)* 62(SD_CMD)* 63(SD_DAT0)* 64(SD_DAT5)* 67(SD_DAT1)* 68(SD_DAT4)* 69(SD_DAT2)* 70(SD_DAT7)* 72(SD_DAT6)* 73(SD_VDD_OVERRIDE)* 75(SD_PWR_ON)* 80(SCL0)* 82(SDA0)* 88(CM5_1.8V(Output))* 90(CM5_1.8V(Output))* 97(CAM_GPIO0)* 99(PMIC_Enable)* 100(CAM_GPIO1)* 115(MIPI0_D0_N)* 117(MIPI0_D0_P)* 121(MIPI0_D1_N)* 123(MIPI0_D1_P)* 127(MIPI0_C_N)* 129(MIPI0_C_P)* 133(MIPI0_D2_N)* 135(MIPI0_D2_P)* 139(MIPI0_D3_N)* 141(MIPI0_D3_P)* 175(MIPI1_D0_N)* 177(MIPI1_D0_P)* 181(MIPI1_D1_N)* 183(MIPI1_D1_P)* 187(MIPI1_C_N)* 189(MIPI1_C_P)* 193(MIPI1_D2_N)* 194(MIPI1_D3_N)* 195(MIPI1_D2_P)* 196(MIPI1_D3_P)*; U3 12(PSYS)* 13(IBM)* 14(IAM)*; U7 4(FAULT#)*; U17 2(PG)* 5(NC)*; U19 3(PC14-OSC32_IN(PC14))* 4(PC15-OSC32_OUT(PC15))* 22(PA6)* 23(PA7)* 28(PB2-BOOT1(PB2))* 38(PC7)* 41(PA8)* 50(PA15(JTDI))* 51(PC10)* 52(PC11)* 53(PC12)* 54(PD2)* 55(PB3(JTDOTRACESWO))* 56(PB4(NJTRST))* 57(PB5)*; U31 1(NC)*; USB3 2(D-)* 3(D+)* 4(ID)*

## Notes on the sheets
sheet 1
- Power Display
- Power type-c
- DC-DC MCU 3.3V
- Low Pass Filter
- DC-DC PCIE 3.3V
- Charging & power path
- DC-DC 5.0V
- Выходом данного блока
  является шина SYS ≈ 8V
sheet 2
- Buzzer
- PWR_BUTT
- Pull-up
- Joystick Left
- Joystick Right
- Camera Gimbal
- 2 pos swith
- 2 pos swith
- 3 pos swith
- Button
- SWD
- MCU
- 3 pos swith
- Button
- POWER MCU
- LPF filter ADC
- Pwr_Butt_CM5
sheet 3
- Switch
- USB touch
- FAN Connector
- Power_Led
- PCIe-M2
- eMMC_Led
- Hdmi_5V
- BAT RTC
- HDMI & PoE_Protection
- USB_3.0 & PoE_Protection
- Raspberry Pi Compute Module 5
- Ethernet & PoE_Protection
